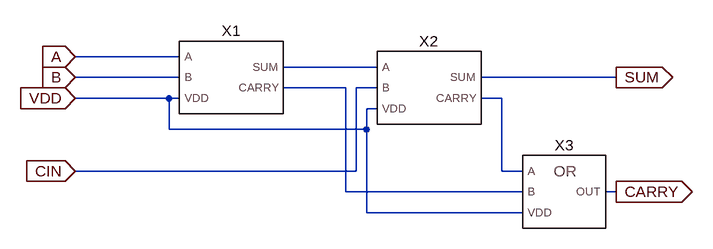
[diagram p0: schematic FULLADDER.asc]
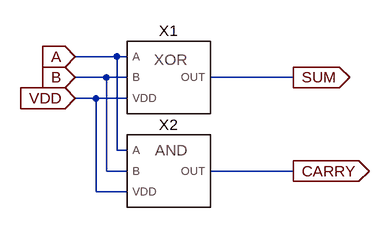
[diagram p1: sub-circuit halfadder.asc]
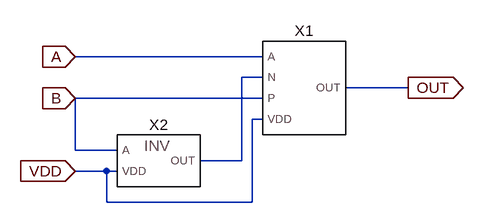
[diagram p2: sub-circuit xorgdi.asc]
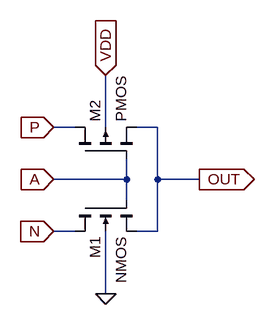
[diagram p3: sub-circuit gdicell.asc]
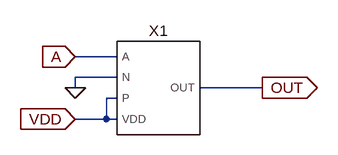
[diagram p4: sub-circuit invgdi.asc]
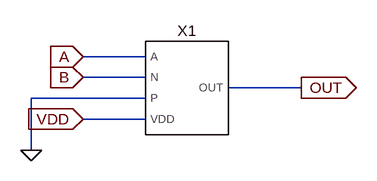
[diagram p5: sub-circuit andgdi.asc]
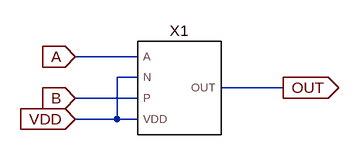
[diagram p6: sub-circuit orgdi.asc]
FULLADDER.asc, the LTspice schematic file:
Version 4
SHEET 1 880 680
WIRE 48 96 -112 96
WIRE 352 112 208 112
WIRE 48 128 -112 128
WIRE 720 128 512 128
WIRE 304 144 208 144
WIRE 352 144 320 144
WIRE 32 160 -112 160
WIRE 48 160 32 160
WIRE 544 160 512 160
WIRE 352 176 336 176
WIRE 32 208 32 160
WIRE 336 208 336 176
WIRE 336 208 32 208
WIRE 320 272 320 144
WIRE 320 272 -112 272
WIRE 544 272 544 160
WIRE 576 272 544 272
WIRE 304 304 304 144
WIRE 576 304 304 304
WIRE 720 304 704 304
WIRE 336 336 336 208
WIRE 576 336 336 336
FLAG -112 96 A
IOPIN -112 96 In
FLAG -112 128 B
IOPIN -112 128 In
FLAG -112 160 VDD
IOPIN -112 160 In
FLAG -112 272 CIN
IOPIN -112 272 In
FLAG 720 128 SUM
IOPIN 720 128 Out
FLAG 720 304 CARRY
IOPIN 720 304 Out
SYMBOL HALFADDER 128 128 R0
SYMATTR InstName X1
SYMBOL HALFADDER 432 144 R0
SYMATTR InstName X2
SYMBOL ORgdi 640 304 R0
SYMATTR InstName X3

halfadder.asc, the sub-circuit schematic file:
Version 4
SHEET 1 880 680
WIRE 144 96 80 96
WIRE 160 96 144 96
WIRE 128 128 80 128
WIRE 160 128 128 128
WIRE 416 128 288 128
WIRE 112 160 80 160
WIRE 160 160 112 160
WIRE 144 240 144 96
WIRE 160 240 144 240
WIRE 128 272 128 128
WIRE 160 272 128 272
WIRE 416 272 288 272
WIRE 112 304 112 160
WIRE 160 304 112 304
FLAG 80 96 A
IOPIN 80 96 In
FLAG 80 128 B
IOPIN 80 128 In
FLAG 80 160 VDD
IOPIN 80 160 In
FLAG 416 128 SUM
IOPIN 416 128 Out
FLAG 416 272 CARRY
IOPIN 416 272 Out
SYMBOL XORgdi 224 128 R0
SYMATTR InstName X1
SYMBOL ANDgdi 224 272 R0
SYMATTR InstName X2

xorgdi.asc, the sub-circuit schematic file:
Version 4
SHEET 1 880 680
WIRE 160 80 -128 80
WIRE 160 112 128 112
WIRE 384 128 288 128
WIRE 160 144 -128 144
WIRE 160 176 144 176
WIRE -128 224 -128 144
WIRE -64 224 -128 224
WIRE 128 240 128 112
WIRE 128 240 64 240
WIRE -80 256 -128 256
WIRE -64 256 -80 256
WIRE -80 304 -80 256
WIRE 144 304 144 176
WIRE 144 304 -80 304
FLAG -128 80 A
IOPIN -128 80 In
FLAG -128 144 B
IOPIN -128 144 In
FLAG 384 128 OUT
IOPIN 384 128 Out
FLAG -128 256 VDD
IOPIN -128 256 In
SYMBOL GDICell 224 128 R0
SYMATTR InstName X1
SYMBOL INVgdi 0 240 R0
SYMATTR InstName X2

gdicell.asc, the sub-circuit schematic file:
Version 4
SHEET 1 880 680
WIRE 176 96 144 96
WIRE 224 96 224 16
WIRE 304 96 272 96
WIRE 256 176 256 144
WIRE 256 176 144 176
WIRE 304 176 304 96
WIRE 368 176 304 176
WIRE 256 208 256 176
WIRE 176 256 144 256
WIRE 304 256 304 176
WIRE 304 256 272 256
WIRE 224 352 224 256
FLAG 144 96 P
IOPIN 144 96 In
FLAG 144 256 N
IOPIN 144 256 In
FLAG 144 176 A
IOPIN 144 176 In
FLAG 368 176 OUT
IOPIN 368 176 Out
FLAG 224 16 VDD
IOPIN 224 16 In
FLAG 224 352 0
SYMBOL nmos4 176 208 M90
SYMATTR InstName M1
SYMATTR Value2 l=65nm w=65nm
SYMBOL pmos4 176 144 R270
SYMATTR InstName M2
SYMATTR Value2 l=162.5nm w=65nm

invgdi.asc, the sub-circuit schematic file:
Version 4
SHEET 1 880 680
WIRE 176 112 112 112
WIRE 176 144 112 144
WIRE 112 160 112 144
WIRE 400 160 304 160
WIRE 176 176 160 176
WIRE 160 208 160 176
WIRE 160 208 112 208
WIRE 176 208 160 208
FLAG 112 112 A
IOPIN 112 112 In
FLAG 112 208 VDD
IOPIN 112 208 In
FLAG 400 160 OUT
IOPIN 400 160 Out
FLAG 112 160 0
SYMBOL GDICell 240 160 R0
SYMATTR InstName X1

andgdi.asc, the sub-circuit schematic file:
Version 4
SHEET 1 880 680
WIRE -32 192 -128 192
WIRE -32 224 -128 224
WIRE 208 240 96 240
WIRE -32 256 -208 256
WIRE -32 288 -128 288
WIRE -208 336 -208 256
FLAG -128 192 A
IOPIN -128 192 In
FLAG -128 224 B
IOPIN -128 224 In
FLAG -128 288 VDD
IOPIN -128 288 In
FLAG 208 240 OUT
IOPIN 208 240 Out
FLAG -208 336 0
SYMBOL GDICell 32 240 R0
SYMATTR InstName X1

orgdi.asc, the sub-circuit schematic file:
Version 4
SHEET 1 880 680
WIRE 160 112 64 112
WIRE 160 144 128 144
WIRE 384 160 288 160
WIRE 160 176 64 176
WIRE 128 208 128 144
WIRE 128 208 64 208
WIRE 160 208 128 208
FLAG 64 112 A
IOPIN 64 112 In
FLAG 64 176 B
IOPIN 64 176 In
FLAG 64 208 VDD
IOPIN 64 208 In
FLAG 384 160 OUT
IOPIN 384 160 Out
SYMBOL GDICell 224 160 R0
SYMATTR InstName X1

The netlist it stands for:
* FULLADDER.asc
XX1 A B VDD N002 N001 halfadder
XX2 N001 CIN VDD N003 SUM halfadder
XX3 N003 N002 VDD CARRY orgdi

* block symbol definitions
.subckt halfadder A B VDD CARRY SUM
XX1 A B VDD SUM xorgdi
XX2 A B VDD CARRY andgdi
.ends halfadder

.subckt xorgdi A B VDD OUT
XX1 A N001 B VDD OUT gdicell
XX2 B VDD N001 invgdi
.ends xorgdi

.subckt gdicell A N P VDD OUT
M1 N A OUT 0 NMOS l=65nm w=65nm
M2 P A OUT VDD PMOS l=162.5nm w=65nm
.ends gdicell

.subckt invgdi A VDD OUT
XX1 A 0 VDD VDD OUT gdicell
.ends invgdi

.subckt andgdi A B VDD OUT
XX1 A B 0 VDD OUT gdicell
.ends andgdi

.subckt orgdi A B VDD OUT
XX1 A VDD B VDD OUT gdicell
.ends orgdi

.model NMOS NMOS
.model PMOS PMOS
.lib standard.mos
.backanno
.end